# EAGLE board ETHERUNO (EAGLE 9.6.2)
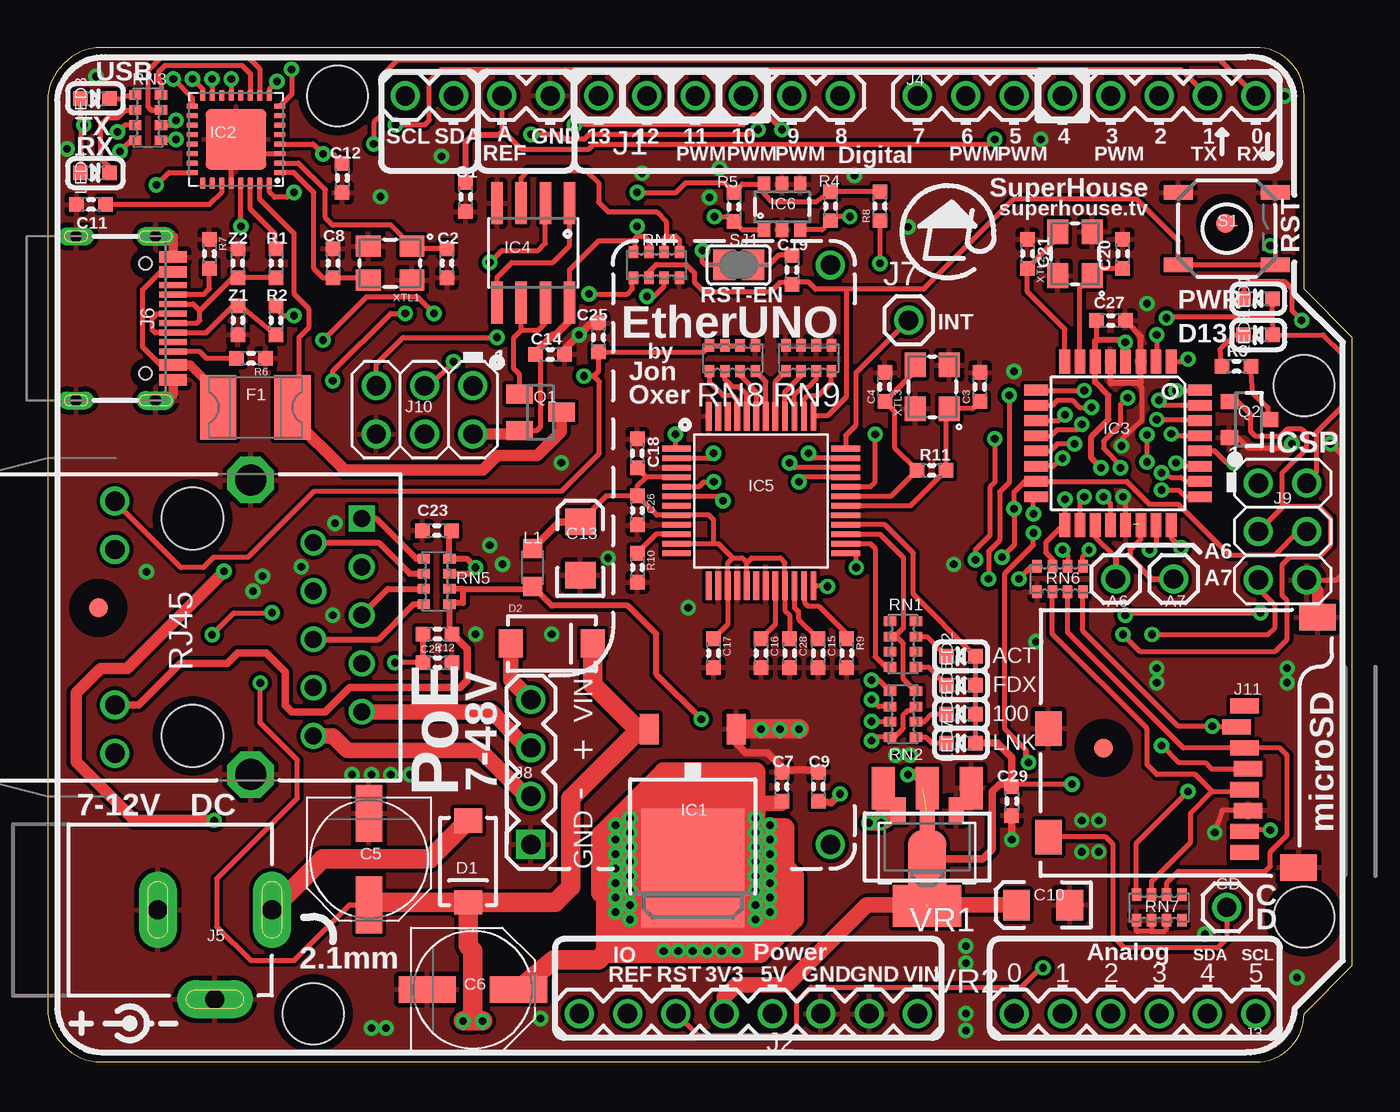
[diagram p4: board, top side]
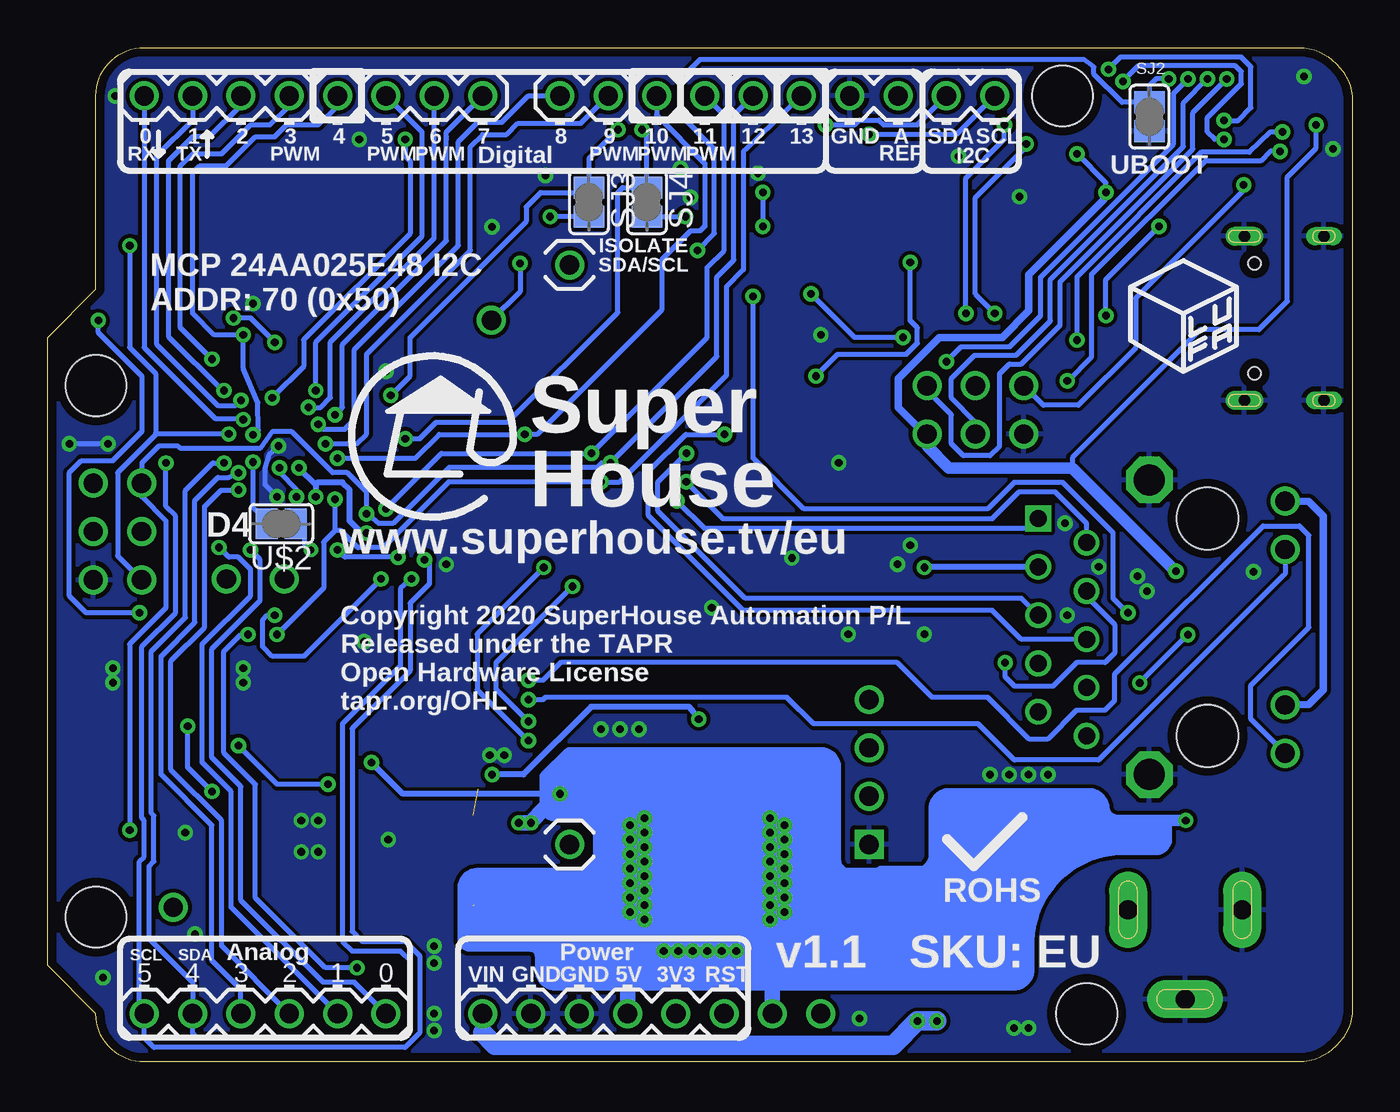
[diagram p5: board, bottom side, seen from below]

Size 68.58 x 53.34 mm. Coordinates in mm from the lower left corner, seen from the top.
Outline: 0,2.54 arc74 2.54,0 63.5,0 arc90 66.04,2.54 68.58,5.08 68.58,38.1 66.04,40.64 66.04,50.8 arc90 63.5,53.34 2.54,53.34 arc74 0,50.8 0,2.54
Copper layers (1*16): Top 0.035mm / dielectric 1.5mm / Bottom 0.035mm
Design rules "SuperHouse-Design-Rules": minimum track width 10mil, minimum drill 24mil, track to track 8mil, track to pad 8mil, pad to pad 8mil, via to via 8mil, smd to smd 6mil, copper to edge 18mil, drill to drill 8mil, minimum pad ring 7mil, minimum via ring 8mil, stop-mask expansion 4mil, vias tented up to drill 0.5mm, thermal gap 10mil
Holes 3.2 mm at 66.04,35.56 66.04,7.62 13.97,2.54 15.24,50.8
tRestrict: area 60.9,43.1 to 62.9,45.1; area 54.5,15.5 to 56.5,17.5; area 1.7,22.9 to 3.7,24.9

## Footprints (pad centres in the part's own frame; a part is rotated, then mirrored left to right if it is on the bottom)
1X01 = drill 1.016: 1 0,0
C0603 = smd 0.762 x 0.762: 1 -0.762,0; 2 0.762,0
PANASONIC_D = smd 3 x 1.4: + 2.4,0; - -2.4,0
EIA3216 = smd 1.4 x 1.6: A 1.4,0; C -1.4,0
SMA-DIODE = smd 1.27 x 1.47: A -2.15,0; C 2.15,0
1812 = smd 1.9 x 3.4: 1 -1.95,0; 2 1.95,0
FIDUCIAL-1X2.5 = smd 1 x 1: 1 0,0
DPACK = smd 1 x 1.6: 1 -2.28,-4.8; 3 2.28,-4.8 | smd 5.4 x 6.2: 2 0,2.5
ATMEL_QFN32 = smd 0.6 x 0.3: 1 -2.3,1.75; 2 -2.3,1.25; 3 -2.3,0.75; 4 -2.3,0.25; 5 -2.3,-0.25; 6 -2.3,-0.75; 7 -2.3,-1.25; 8 -2.3,-1.75; 17 2.3,-1.75; 18 2.3,-1.25; 19 2.3,-0.75; 20 2.3,-0.25; 21 2.3,0.25; 22 2.3,0.75; 23 2.3,1.25; 24 2.3,1.75 | smd 0.3 x 0.6: 9 -1.75,-2.3; 10 -1.25,-2.3; 11 -0.75,-2.3; 12 -0.25,-2.3; 13 0.25,-2.3; 14 0.75,-2.3; 15 1.25,-2.3; 16 1.75,-2.3; 25 1.75,2.3; 26 1.25,2.3; 27 0.75,2.3; 28 0.25,2.3; 29 -0.25,2.3; 30 -0.75,2.3; 31 -1.25,2.3; 32 -1.75,2.3 | smd 3.2 x 3.2: EXP 0,0
TQFP32-08 = smd 1.27 x 0.559: 1 -4.293,2.8; 2 -4.293,2; 3 -4.293,1.2; 4 -4.293,0.4; 5 -4.293,-0.4; 6 -4.293,-1.2; 7 -4.293,-2; 8 -4.293,-2.8; 17 4.293,-2.8; 18 4.293,-2; 19 4.293,-1.2; 20 4.293,-0.4; 21 4.293,0.4; 22 4.293,1.2; 23 4.293,2; 24 4.293,2.8 | smd 0.559 x 1.27: 9 -2.8,-4.293; 10 -2,-4.293; 11 -1.2,-4.293; 12 -0.4,-4.293; 13 0.4,-4.293; 14 1.2,-4.293; 15 2,-4.293; 16 2.8,-4.293; 25 2.8,4.293; 26 2,4.293; 27 1.2,4.293; 28 0.4,4.293; 29 -0.4,4.293; 30 -1.2,4.293; 31 -2,4.293; 32 -2.8,4.293
SO08 = smd 0.61 x 2.21: 1 -1.905,-2.616; 2 -0.635,-2.616; 3 0.635,-2.616; 4 1.905,-2.616; 5 1.905,2.616; 6 0.635,2.616; 7 -0.635,2.616; 8 -1.905,2.616
LQFP48 = smd 1.5 x 0.3: 1 -4.45,2.75; 2 -4.45,2.25; 3 -4.45,1.75; 4 -4.45,1.25; 5 -4.45,0.75; 6 -4.45,0.25; 7 -4.45,-0.25; 8 -4.45,-0.75; 9 -4.45,-1.25; 10 -4.45,-1.75; 11 -4.45,-2.25; 12 -4.45,-2.75; 25 4.45,-2.75; 26 4.45,-2.25; 27 4.45,-1.75; 28 4.45,-1.25; 29 4.45,-0.75; 30 4.45,-0.25; 31 4.45,0.25; 32 4.45,0.75; 33 4.45,1.25; 34 4.45,1.75; 35 4.45,2.25; 36 4.45,2.75 | smd 0.3 x 1.5: 13 -2.75,-4.45; 14 -2.25,-4.45; 15 -1.75,-4.45; 16 -1.25,-4.45; 17 -0.75,-4.45; 18 -0.25,-4.45; 19 0.25,-4.45; 20 0.75,-4.45; 21 1.25,-4.45; 22 1.75,-4.45; 23 2.25,-4.45; 24 2.75,-4.45; 37 2.75,4.45; 38 2.25,4.45; 39 1.75,4.45; 40 1.25,4.45; 41 0.75,4.45; 42 0.25,4.45; 43 -0.25,4.45; 44 -0.75,4.45; 45 -1.25,4.45; 46 -1.75,4.45; 47 -2.25,4.45; 48 -2.75,4.45
SOT23-6 = smd 0.65 x 0.8: 1 -0.95,-1.2; 2 0,-1.2; 3 0.95,-1.2; 4 0.95,1.2; 5 0,1.2; 6 -0.95,1.2
1X10-S = drill 1.016: 1 -11.43,0; 2 -8.89,0; 3 -6.35,0; 4 -3.81,0; 5 -1.27,0; 6 1.27,0; 7 3.81,0; 8 6.35,0; 9 8.89,0; 10 11.43,0
1X08-S = drill 1.016: 1 -8.89,0; 2 -6.35,0; 3 -3.81,0; 4 -1.27,0; 5 1.27,0; 6 3.81,0; 7 6.35,0; 8 8.89,0
1X06-S = drill 1.016: 1 -6.35,0; 2 -3.81,0; 3 -1.27,0; 4 1.27,0; 5 3.81,0; 6 6.35,0
POWER_JACK_SLOTS = drill 1 pad 2 long: GND 0,7.7; GNDBREAK 4.7,10.7; PWR 0,13.7
USB-C-16P = smd 0.6 x 1.45: A1B12 -3.225,5.095; A4B9 -2.45,5.095; A9B4 2.45,5.095; A12B1 3.225,5.095 | smd 0.3 x 1.45: A5 -1.25,5.095; A6 -0.25,5.095; A7 0.25,5.095; A8 1.25,5.095; B5 1.75,5.095; B6 0.75,5.095; B7 -0.75,5.095; B8 -1.75,5.095 | drill 0.6 pad 0.8 long: FIX1 -4.32,0; FIX4 4.32,0 | drill 0.6 pad 1 long: FIX2 -4.32,4.18; FIX3 4.32,4.18 | hole 0.65: 2.89,3.65; -2.89,3.65
FT-POE-MODULE-NOLABEL = drill 1.016 square: 1 0,0 | drill 1.016: 2 2.54,0; 3 5.08,0; 4 7.62,0; MNT1 0,-15.748; MNT2 30.48,-15.748
2X03-ICSP = drill 1.016: 1 -2.54,-1.27; 2 -2.54,1.27; 3 0,-1.27; 4 0,1.27; 5 2.54,-1.27; 6 2.54,1.27
MICRO-SD-SOCKET-PP = smd 0.8 x 1.5: 1 -8.94,10.7; 2 -7.84,10.3; 3 -6.74,10.7; 4 -5.64,10.9; 5 -4.54,10.7; 6 -3.44,10.9; 7 -2.34,10.7; 8 -1.24,10.7 | smd 1.8 x 1.4: CD1 -2.05,0.4; CD2 -7.75,0.4 | smd 1.4 x 1.9: GND1 -0.45,13.55; GND2 -13.6,14.55
L2012C = smd 1 x 1: 1 -1,0; 2 1,0
LED-0603 = smd 0.762 x 0.762: A -0.762,0; C 0.762,0
SOT23 = smd 1 x 1.4: 1 -0.95,-1.1; 2 0.95,-1.1; 3 0,1.1
SOT23-3 = smd 0.8 x 0.9: 1 -0.95,-1; 2 0.95,-1; 3 0,1.1
R0603 = smd 0.762 x 0.762: 1 -0.762,0; 2 0.762,0
CAY16 = smd 0.5 x 0.65: 1 -1.2,-0.675; 2 -0.4,-0.675; 3 0.4,-0.675; 4 1.2,-0.675; 5 1.2,0.675; 6 0.4,0.675; 7 -0.4,0.675; 8 -1.2,0.675
TACTILE_SMT-6MM = smd 1.524 x 0.762: 1 -2.54,1.905; 2 2.54,1.905; 3 -2.54,-1.905; 4 2.54,-1.905
SJC = smd 1.168 x 1.6: 1 -0.762,0; 2 0.762,0
SJ = smd 1.168 x 1.6: 1 -0.762,0; 2 0.762,0
HY931147C = drill 1.63 octagon: GND1 3.05,7.745; GND2 3.05,-7.745 | drill 0.9 square: P$1 8.89,5.715 | drill 0.9: P$2 6.35,4.445; P$3 8.89,3.175; P$4 6.35,1.905; P$5 8.89,0.635; P$6 6.35,-0.635; P$7 8.89,-1.905; P$8 6.35,-3.175; P$9 8.89,-4.445; P$10 6.35,-5.715 | drill 1.016: P$11 -4.08,6.625; P$12 -4.08,4.085; P$13 -4.08,-4.085; P$14 -4.08,-6.625 | hole 3.25: 0,5.715; 0,-5.715
SOT89 = smd 0.8 x 1.4: 1 -1.524,-1.905; 3 1.524,-1.905 | smd 0.8 x 1.9: 2 0,-1.651 | smd 2.032 x 3.65: 4 0,0.94
SOT-223 = smd 1.219 x 2.235: 1 -2.311,-3.099; 2 0,-3.099; 3 2.311,-3.099 | smd 3.6 x 2.2: 4 0,3.099
CRYSTAL-SMD-3X2 = smd 1.3 x 1.1: 1 -1.15,-0.9; 2 1.15,-0.9; 3 1.15,0.9; 4 -1.15,0.9
TVS0603 = smd 0.762 x 0.762: 1 -0.762,0; 2 0.762,0

## Placement (x,y rotation side)
A6  A6  [1X01]  56.13,25.4 0 top
A7  A7  [1X01]  59.18,25.4 0 top
C1  100nF 0603  [C0603]  21.97,45.48 270 top
C2  22pF 0603  [C0603]  21,42 90 top
C3  18pF  [C0603]  49,35.5 90 top
C4  18pF  [C0603]  44,35.5 90 top
C5  47uF 25V  [PANASONIC_D]  16.89,10.67 270 top
C6  47uF 25V  [PANASONIC_D]  22.35,3.81 0 top
C7  100nF 0603  [C0603]  38.61,14.48 90 top
C8  22pF 0603  [C0603]  15,42 270 top
C9  1uF 0603  [C0603]  40.51,14.48 90 top
C10  10uF 6.3V A TANT  [EIA3216]  52.32,8.26 180 top
C11  1uF 0603  [C0603]  2.29,45.09 180 top
C12  100nF 0603  [C0603]  15.49,46.48 270 top
C13  10uF 6.3V A TANT  [EIA3216]  28,27 90 top
C14  100nF  [C0603]  26.42,37.21 0 top
C15  10nF  [C0603]  40.5,21.5 270 top
C16  4.7uF  [C0603]  37.5,21.5 270 top
C17  100nF  [C0603]  35,21.5 270 top
C18  10nF  [C0603]  31,32 90 top
C19  100nF 0603  [C0603]  39.12,41.66 270 top
C20  15pF  [C0603]  56.5,42.5 270 top
C21  15pF  [C0603]  51.5,42.5 270 top
C23  10nF  [C0603]  20.45,27.94 180 top
C24  22nF  [C0603]  20.5,21 0 top
C25  100nF  [C0603]  28.96,38.1 90 top
C26  100nF  [C0603]  31,29 270 top
C27  100nF 0603  [C0603]  55.88,38.99 0 top
C28  100nF  [C0603]  39,21.5 270 top
C29  100nF  [C0603]  50.67,13.72 270 top
CD  M01-PLAIN  [1X01]  61.98,8.13 0 top
D1  1N4004  [SMA-DIODE]  22.1,10.54 270 top
D2  1N4004  [SMA-DIODE]  26.5,22 0 top
F1  500mA PTC 1812  [1812]  10.92,34.42 0 top
FID1  FIDUCIAL1X2.5  [FIDUCIAL-1X2.5]  61.9,44.1 0 top
FID2  FIDUCIAL1X2.5  [FIDUCIAL-1X2.5]  55.5,16.51 0 top
FID3  FIDUCIAL1X2.5  [FIDUCIAL-1X2.5]  2.67,23.88 0 top
IC1  MC33269DT-5.0  [DPACK]  33.91,12.7 180 top
IC2  ATMEGA16U2-MU  [ATMEL_QFN32]  9.91,48.51 180 top
IC3  ATMEGA328P TQFP32  [TQFP32-08]  56.26,32.53 270 top
IC4  LM358D  [SO08]  25.53,42.55 180 top
IC5  W5500-LQFP  [LQFP48]  37.5,29.5 0 top
IC6  MCP24AA025E48  [SOT23-6]  38.61,44.96 0 top
J1  Digital_8_13  [1X10-S]  30.23,50.8 180 top
J2  Power  [1X08-S]  36.83,2.54 0 top
J3  Analog  [1X06-S]  57.15,2.54 0 top
J4  Digital_0_7  [1X08-S]  54.61,50.8 180 top
J5  DC_2_1MM  [POWER_JACK_SLOTS]  -1.91,8 270 top
J6  USB-C-16P-16P  [USB-C-16P]  1.5,39.1 270 top
J7  INT  [1X01]  45.25,39 0 top
J8  FT-POE-MODULE3  [FT-POE-MODULE-NOLABEL]  25.4,11.43 90 top
J9  ICSP:MAIN  [2X03-ICSP]  64.91,27.89 270 top
J10  ICSP:USB  [2X03-ICSP]  19.81,34.29 180 top
J11  microSD  [MICRO-SD-SOCKET-PP]  52.2,9.78 270 top
L1  1uH 250mA 0805  [L2012C]  25.5,26 90 top
LED1  PWR/BLUE  [LED-0603]  63.63,40.13 180 top
LED2  YELLOW  [LED-0603]  48.01,21.34 180 top
LED3  TX/YEL  [LED-0603]  2.5,50.65 0 top
LED4  RX/GRN  [LED-0603]  2.5,46.76 0 top
LED5  GREEN  [LED-0603]  48.01,19.81 180 top
LED6  GREEN  [LED-0603]  48.01,18.29 180 top
LED7  YELLOW  [LED-0603]  48.01,16.76 180 top
LED8  D13/RED  [LED-0603]  63.63,38.23 180 top
Q1  FDN340P  [SOT23]  25.91,34.16 270 top
Q2  2N7002  [SOT23-3]  63.12,33.78 270 top
R1  22R  [R0603]  12,42 270 top
R2  22R  [R0603]  12,39 270 top
R3  1K  [R0603]  62.48,36.58 180 top
R4  4K7  [R0603]  41.15,45 270 top
R5  4K7  [R0603]  36.07,44.96 270 top
R6  5K1  [R0603]  10.7,37 180 top
R7  5K1  [R0603]  8.5,42.5 270 top
R8  10K  [R0603]  43.75,45 90 top
R9  10K  [R0603]  42,21.5 270 top
R10  12.4K 1%  [R0603]  31,26 270 top
R11  1M  [R0603]  46.47,31.11 0 top
R12  10R  [R0603]  20.5,22.5 180 top
RN1  1K  [CAY16]  44.96,21.97 270 top
RN2  1K  [CAY16]  44.96,18.29 270 top
RN3  1K  [CAY16]  5.28,49.66 270 top
RN4  10K  [CAY16]  32,41.91 0 top
RN5  49R9 1%  [CAY16]  20.45,25.27 270 top
RN6  1K  [CAY16]  53.21,25.4 0 top
RN7  2K2  [CAY16]  58.42,8.13 0 top
RN8  10K  [CAY16]  36,37 0 top
RN9  10K  [CAY16]  40,37 0 top
S1  RESET  [TACTILE_SMT-6MM]  61.98,43.81 0 top
SJ1  RESET-EN  [SJC]  36.32,41.91 0 top
SJ2  UBOOT  [SJ]  10.67,49.7 90 bottom
SJ3  SJC-NORMAL  [SJC]  40.13,45.21 270 bottom
SJ4  SJC-NORMAL  [SJC]  37.08,45.21 270 bottom
U1  HY931147C-RJ45  [HY931147C]  7.62,22.86 0 top
U$2  SJC-NORMAL  [SJC]  56.3,28.3 180 bottom
VR1  LD1117-SOT89  [SOT89]  46.23,11.3 180 top
VR2  LD1117-SOT223  [SOT-223]  46.23,11.3 180 top
XTL1  16MHz  [CRYSTAL-SMD-3X2]  18,42 180 top
XTL2  16MHz  [CRYSTAL-SMD-3X2]  54,42.5 90 top
XTL3  25MHz  [CRYSTAL-SMD-3X2]  46.5,35.5 90 top
Z1  PGB1010603  [TVS0603]  10,39 270 top
Z2  PGB1010603  [TVS0603]  10,42 90 top

## Tracks (layer width: path | path; a pad name or v marks a point on that pad's centre or on a via)
1V2O
  Top 0.254: C15.1 39.46,23.3 39.46,23.69 39.25,23.9 IC5.22
3.3V  (via drill 0.4)  (2 unrouted)
  Top 0.254: J11.4 61.16,15.42 60.83,15.75 59.44,15.75 v58.55,16.64 | IC4.2 26.16,43.05 25.78,42.67 23.88,42.67 v23.24,42.04 | 28.7,36.07 v28.19,36.07 | 28.7,36.07 28.96,36.32 C25.1 34.46,37.34 RN8.8 RN8.7 RN8.6 | v53.85,14.61 50.8,14.61 C29.1 | LED7.A LED6.A LED5.A LED2.A 45.5,24.6 45.5,26.75 44,28.25 IC5.28 | 46.23,12.75 46.23,10.75 VR2.4 | VR2.4 | U1.P$11 3.54,29.46 7,26 8.17,26 8.7,26.53 10.53,26.53 14,30 27,30 29,32 29,35.77 28.7,36.07
  Top 0.305: 21.84,24.87 RN5.6 | 21.84,24.87 21.84,24.13 21.12,24.13 RN5.5 21.12,22.64 R12.1 | 21.84,24.87 25.37,24.87 L1.1 26.5,24 30.5,24 32,22.5 32,20.39 v34.35,18.03
  Top 0.406: U1.P$13 4.8,18.77 6.98,20.95 9.46,20.95 10,21.5 11.5,21.5 12.5,20.5 12.5,18.74 12.83,18.41 14.61,18.41 15.88,19.68 21.68,19.68 22.05,20.05 22.05,21.71 R12.1 | LED7.A 49.91,16.76 50.67,16 C29.1 50.63,14.61 50.04,14.61 49.66,14.22 49.66,11.18 49.15,10.67 46.31,10.67 46.23,10.75 | 45.97,14.35 46.02,14.4 | VR2.4 46.23,12.75 46.23,14 VR2.2 | VR1.4 VR2.4 | VR2.4 | VR2.4 46.23,8.25
  Top 0.61: 46.02,14.4 VR2.2 46.31,14.32 46.31,10.67 | v45.21,15.11 45.89,15.11 46.23,14.77 46.23,14
  Top 0.813: 46.18,8.26 C10.A | 46.23,8.25 43.05,8.25 41.27,6.48 38.86,4.06 36.2,4.06 35.56,3.43 J2.4
  Bottom 0.254: v58.55,16.64 56.52,14.61 v53.85,14.61 | v23.24,42.04 23.24,38.99 22.86,38.61 22.86,37.8 23.44,37.21 27.05,37.21 v28.19,36.07
  Bottom 0.305: v34.35,18.03 34.86,18.67 40.01,18.67 43.57,15.11 v45.21,15.11
  Bottom 0.406: U1.P$13 2.29,18.8 1.52,19.56 1.52,28.7 2.29,29.46 U1.P$11
3V3A
  Top 0.254: IC5.17 36.75,26.25 | 36.75,26.25 36.5,26.5 36,26.5 | 36,26.5 35.75,26.25 IC5.15 35.75,23.01 C17.1 | C28.1 39,23.5 38.75,23.75 IC5.21 38.75,26.25 38.5,26.5 37,26.5 36.75,26.25 | IC5.11 35,27.25 | 35,27.25 35.25,27.25 36,26.5 | 35,27.25 35,28.5 34.75,28.75 IC5.8 32.01,28.75 C26.1 | IC5.4 33.03,30.77 31.47,30.77 | 31.47,30.77 C18.1 | C26.1 31,30.3 31.47,30.77 | 27.91,28.41 C13.A 29.36,29.76 C26.1
  Top 0.406: 27.27,28.4 C13.A 26.9,28.4 L1.2
5V  (via drill 0.4)
  Top 0.254: 1.75,49.28 LED3.A | IC2.32 11.66,45.75 11.94,45.47 12.57,45.47 v12.95,45.72 | 1.75,49.28 LED4.A | v1.91,49.28 1.75,49.28 | 64.38,39.19 LED8.A 67.06,38.23 68.07,37.21 68.07,34.48 66.67,33.08 66.67,30.99 66.18,30.49 J9.2 | 64.38,39.19 LED1.A | IC3.18 54.26,29.5 v54.48,29.72 | RN4.7 31.6,43.2 31.37,43.43 30.99,43.43 | 30.99,43.43 30.86,43.31 30.86,43.18 | 30.86,43.18 30.86,42.64 RN4.8 | IC4.8 27.43,41.66 28.96,43.18 30.86,43.18 | C14.1 25.91,36.87 25.91,33.4 25.72,33.21 Q1.2 | 64.38,39.19 58.85,39.19 v58.8,39.12 | v56.64,37.85 56.64,37.83 56.53,37.72 | IC1.2 34.04,10.2 34.04,10.16 | 37.21,13.59 37.08,13.59 v37.21,12.83 | 29.84,10.41 v29.84,10.16 | 29.72,9.78 29.84,9.65 v29.84,9.4 | v29.84,7.87 v29.84,8.64 30.23,8.64 | 36.45,6.48 36.7,6.48 36.83,6.35 36.45,6.35 | v51.82,27.81 51.82,27.18 50.29,25.65 50.29,17.53 51.44,16.38 51.44,16.26 | 37.85,12.45 v37.97,12.45 37.97,12.32 | v30.99,43.94 30.99,43.43 | v30.99,45.72 33.02,45.72 33.53,46.23 35.56,46.23 R5.1 36.51,46.16 IC6.6 37.66,45.65 38.1,45.21 40.39,45.21 R4.1 R8.2 | C27.1 55.12,37.97 | IC2.4 13.95,48.26 v14.47,47.75 14.98,47.75 C12.1
  Top 0.305: IC3.4 56.66,37.59 56.53,37.72 56.26,37.97 55.12,37.97 55.06,37.92 IC3.6 55.06,35.74 55.75,35.05 55.75,33.78 54.86,32.89 54.86,31.75 v55.37,31.24 | 51.44,16.26 51.44,15.88 v51.56,15.75
  Top 0.406: 38.57,13.59 C7.1 | C9.1 41.19,13.63 v41.66,14.1 | IC4.8 27.43,38.99 26.67,38.23 26.54,38.23 25.57,37.25 C14.1 | VR2.3 43.92,14.88
  Top 0.61: Q1.2 24.61,33.02 J10.2 | v9.28,25.8 4.18,20.7 2.79,20.7 1.5,19.41 1.5,15.77 4.57,12.7 v8.76,12.7 | v36.2,5.84 v35.43,5.84 v34.67,5.84 v33.91,5.84 v33.15,5.84 v32.38,5.84 | v36.2,5.84 36.2,6.1 36.45,6.1 | 36.45,6.48 36.45,6.35 36.45,5.84 v36.2,5.84 | 30.23,10.67 30.23,10.54 v30.61,10.54 | VR1.3 44.07,12.57 v43.81,12.57
  Top 0.813: 37.21,13.59 38.57,13.59 | v30.61,7.49 v30.61,10.54 v30.61,12.83 30.86,12.83 | v37.21,7.49 v37.21,8.26 v37.21,9.02 37.21,12.32 v37.21,12.83 | v43.18,12.57 v43.81,12.57 43.92,12.68 VR2.3
  Top 1.016: C6.+ 26.6,5.37 28.96,5.37 30.23,6.86 | IC1.2 30.23,6.86 | 34.04,15.24 34.04,10.16 | 34.04,15.24 32.38,15.24 29.08,11.94 29.08,8.89 29.34,9.78 | 29.34,9.78 29.34,5.71 37.21,5.71 | 37.21,5.71 37.21,12.32 | 37.21,12.32 37.21,13.59 37.21,15.24 34.04,15.24 | 29.34,9.78 29.72,9.78 30.86,10.92 30.86,12.83 32.64,14.61 36.45,14.61 36.45,6.48 30.23,6.48 30.23,6.86 | 30.23,6.86 30.23,8.64 30.99,9.4 30.99,6.99 35.94,6.99 35.94,13.84 32.26,13.84 32,13.59 36.07,13.59 | 29.84,10.41 29.84,12.19 30.23,12.19 30.23,10.67 | 37.21,5.71 37.47,5.71 39.24,7.49 39.24,9.78 38.73,10.29 38.73,12.32 38.61,12.32 | 37.97,12.32 38.61,12.32 | 37.21,12.32 37.97,12.32 | 37.97,12.32 v37.97,11.68 v37.97,10.92 v37.97,10.16 v37.97,9.4 v37.97,8.64 v37.97,7.87 37.97,6.73 | 38.61,12.32 38.61,6.99 | 31.24,11.18 31.24,9.91 29.97,9.91 29.97,9.4 | 29.97,9.4 29.97,9.14 | v29.84,9.4 29.97,9.4
  Bottom 0.254: v1.91,49.28 1.91,48.05 3.42,46.54 3.42,40 4.92,38.5 8,38.5 14.72,31.78 14.72,31.24 | v41.66,14.1 41.7,14.1 42.16,13.63 42.16,13.84 42.29,13.97 42.29,14.35 | v58.8,39.12 57.91,39.12 v56.64,37.85 | 42.42,13.34 42.44,13.35 | 42.29,13.21 42.16,13.34 | 40.26,14.73 40.39,14.86 40.64,14.86 | J10.2 22.48,33.02 | 21.97,12.7 21.84,12.57 21.84,12.45 | 21.84,11.94 21.97,11.81 21.97,11.56 21.84,11.56 | 21.97,11.18 21.84,11.18 | 21.97,10.92 21.84,10.79 21.84,10.41 | 15.11,10.41 17.02,10.29 15.62,10.03 15.88,9.78 15.88,9.65 16.26,9.27 16.51,9.02 16.51,8.89 | 17.27,8.13 17.27,7.87 | 21.21,14.1 21.21,13.84 | v29.84,11.68 v29.84,12.45 | v29.84,10.92 30.23,10.54 v30.61,10.54 | 36.83,6.35 35.69,6.35 35.56,6.48 | v12.95,45.72 12.95,46.23 v14.47,47.75 | v30.99,45.72 v30.99,43.94
  Bottom 0.305: 54.48,30.35 v55.37,31.24 | 54.48,30.35 v54.48,29.72 | 54.48,30.35 54.36,30.48 53.09,30.48 52.7,30.1 52.7,28.45 52.07,27.81 v51.82,27.81 | v51.56,15.75 49.91,14.1 v41.66,14.1
  Bottom 0.406: 22.48,33.02 23.88,34.42 23.88,35.94 21.72,38.1 18.41,38.1 17.02,39.5 17.02,41.4 13.08,45.34 v12.95,45.72
  Bottom 0.61: J10.2 22.35,32.38 21.21,31.24 14.72,31.24 v9.28,25.8 | 9.78,12.7 9.78,11.81 arc90 10.29,11.18 11.81,11.18 arc-90 17.02,6.35 | 17.02,6.35 17.45,9.86 | 17.45,9.86 19.81,7.49 v30.61,7.49 | 41.17,16.26 41.1,16.08 | 42.42,13.46 42.42,13.34 42.29,13.21 42.16,13.08 39.5,13.08 | 42.29,14.35 42.16,14.48 | 42.16,14.48 40.77,15.88 | 42.16,13.84 40.64,15.37 | 42.16,13.34 40.64,14.86 | 40.26,14.73 41.78,13.21 | 17.45,9.86 26.37,9.86 arc90 27.18,10.67 27.18,15.49 arc-90 27.94,16.26 41.17,16.26 | 41.17,16.26 42.42,15.01 42.42,13.46 | 42.42,13.46 arc-90 41.91,12.95 40.64,12.95 arc90 39.62,11.94 39.62,11.68 | 39.62,11.18 39.62,10.92 arc90 40.64,9.91 45.97,9.91 arc-90 46.74,9.14 | 42.67,5.59 42.67,4.83 arc-90 41.91,4.06 17.78,4.06 arc-90 17.02,4.83 17.02,5.08 | 46.74,6.48 arc-90 46.35,6.1 43.18,6.1 | 46.74,6.99 46.74,7.49 | 46.74,8.13 46.74,8.64 | 17.02,6.1 17.02,5.59 | 17.02,6.6 17.02,7.11 | 17.02,7.62 17.02,9.14 | 17.02,9.14 arc-90 17.78,9.91 27.18,9.91 | 27.18,9.91 27.94,9.91 | 27.94,9.91 27.94,7.48 | 17.02,9.14 46.74,9.14 | 46.74,9.14 46.74,8.64 | 46.74,8.64 17.27,8.64 17.27,8.13 46,8.13 46.74,8.13 | 46.74,7.49 46.74,8.13 | 17.02,7.62 46.74,7.49 | 17.02,7.11 17.02,7.62 | 17.02,7.11 46.74,6.99 | 46.74,6.48 46.74,6.99 | 17.02,6.6 46.74,6.48 | 17.02,6.35 17.02,6.6 | 17.02,6.35 17.02,6.1 | 17.02,6.1 43.18,6.1 | 43.18,6.1 arc90 42.67,5.59 | 17.02,5.59 42.67,5.59 | 17.02,5.59 17.02,5.08 | 17.02,5.08 30.5,5.08 42.42,5.08 42.42,4.57 17.53,4.57 17.27,7.87 | 17.27,7.87 17.14,9.53 | 17.14,9.53 42.16,9.4 42.16,9.65 39.62,9.65 39.62,9.91 27.94,9.91 | 27.18,9.91 27.18,10.16 39.62,10.16 39.62,10.67 27.43,10.67 27.43,11.18 39.62,11.18
  Bottom 0.61: 39.62,11.18 39.62,11.68 | 39.62,11.68 v29.84,11.68 27.43,11.68 27.43,12.19 39.37,12.19 39.37,12.45 | 39.37,12.45 39.62,12.45 | 39.37,12.45 v29.84,12.45 27.43,12.45 27.43,12.95 39.62,12.95 39.62,13.46 27.43,13.46 27.43,13.97 42.16,13.97 42.16,14.48 | 42.16,14.48 27.43,14.48 27.43,14.99 41.91,14.99 41.91,15.24 41.15,15.24 | 41.15,15.24 27.43,15.24 27.43,15.75 41.15,15.75 41.15,15.24 | 22.99,9.91 arc-90 21.97,10.92 21.97,11.18 21.97,11.56 21.97,12.7 | 21.97,13.34 21.97,12.95 | 21.97,12.95 21.97,12.7 | 21.97,13.34 arc90 21.21,14.1 13.84,14.1 arc90 13.08,13.34 13.08,13.46 arc-90 12.32,12.7 9.78,12.7 | v8.76,12.7 9.78,12.7 | 13.46,13.84 21.21,13.84 21.46,13.84 | 21.97,13.34 13.34,13.34 | 21.97,12.95 12.95,12.95 | 21.97,12.7 12.57,12.7 | 21.84,12.45 10.03,12.45 | 21.84,11.94 10.03,11.94 | 21.84,11.56 10.16,11.56 | 21.84,11.18 13.59,11.18 | 21.84,10.79 14.48,10.79 | 15.11,10.41 21.84,10.41 21.97,10.41 | 15.62,10.03 24.77,10.03 | 17.14,9.53 46.48,9.53 | 17.27,7.87 46.61,7.87 | 15.88,9.65 23.62,9.65 | 16.26,9.27 24,9.27 | 16.51,8.89 24.26,8.89
  Bottom 0.813: 38.1,6.6 37.97,6.6 v37.21,7.49 v37.21,8.26 v37.21,9.02 | v30.61,7.49 v30.61,8.26 v30.61,9.02 v30.61,9.78 v30.61,10.54 v30.61,11.3 | v30.61,12.06 v30.61,12.83 30.73,11.68 30.86,11.56 30.86,11.3 | v37.21,12.83 v37.21,12.06 v37.21,11.3 v37.21,10.54 v37.21,9.78 | v37.21,12.83 37.08,13.59 37.21,13.72 v37.21,12.83 | 43.22,12.57 v43.81,12.57 | 43.22,12.57 v43.18,12.57 | 43.22,12.57 42.44,13.35 42.16,13.63 37.88,13.63 v37.21,12.83 | J2.5 38.1,6.35 36.83,6.35 36.45,6.35 | J2.2 30.48,5.06 30.5,5.08
  Bottom 1.016: 36.83,6.35 36.7,6.35 v36.2,5.84
A0  (via drill 0.4)
  Top 0.254: v57.91,26.92 58.29,27.3 58.29,28.2 IC3.23
  Bottom 0.254: J3.1 52.45,4.19 54.1,4.19 58.42,8.51 58.42,14.48 59.94,16 59.94,21.72 57.4,24.26 57.4,26.42 v57.91,26.92
A1  (via drill 0.4)
  Top 0.254: v59.56,27.05 59.06,27.55 IC3.24
  Bottom 0.254: J3.2 58.93,8.13 58.93,14.22 60.45,15.75 60.45,21.97 57.91,24.51 57.91,25.91 58.55,26.54 59.05,26.54 v59.56,27.05
A2  (via drill 0.4)
  Top 0.254: IC3.25 59.81,29.73 59.46,30.07 v58.55,30.07
  Bottom 0.254: J3.3 59.44,6.1 59.44,12.7 62.1,15.37 62.1,21.08 60.33,22.86 60.33,29.21 59.46,30.07 v58.55,30.07
A3  (via drill 0.4)
  Top 0.254: IC3.26 59.87,30.53 59.56,30.73 59.05,30.73 v58.55,30.99
  Bottom 0.254: J3.4 58.42,3.81 59.94,5.33 59.94,12.45 62.61,15.11 62.61,21.34 60.83,23.11 60.83,29.53 59.63,30.73 59.05,30.73 v58.55,30.99
A4_SDA  (via drill 0.4)
  Top 0.254: IC3.27 59.48,31.33 v59.31,31.5 | v50.55,35.05 50.55,30.48 50.04,29.97 50.04,27.43 49.45,26.85 v49.45,25.4 | v38.61,49.02 37.85,49.78 37.08,49.78 36.58,49.28 v27.69,49.28
  Bottom 0.254: J1.9 22.86,49.28 24.64,49.28 24.89,49.53 25.91,49.53 26.16,49.28 v27.69,49.28 | v59.31,31.5 59.89,31.5 61.34,30.04 61.34,23.37 63.12,21.59 63.12,13.08 62.99,12.95 62.99,10.54 63.25,10.29 63.25,6.48 60.96,4.19 J3.5 60.96,1.52 60.71,1.27 50.04,1.27 49.53,1.78 49.53,5.33 50.04,5.84 52.58,5.84 53.09,6.35 53.09,17.78 50.04,20.83 50.04,24.89 v49.45,25.4 | v38.61,49.02 40.13,47.5 SJ3.1 40.39,45.72 42.67,45.72 43.43,44.96 43.43,44.2 49.53,38.1 49.53,36.07 v50.55,35.05
A5_SCL  (via drill 0.4)
  Top 0.254: IC3.28 61.34,32.13 61.98,31.5 v62.36,31.5 | v49.78,32.77 49.78,30.48 49.53,30.23 49.53,27.69 48.77,26.92 v48.77,26.42 | v37.34,49.02 37.08,49.02 36.83,48.77 28.45,48.77 28.19,48.51 27.18,48.51 26.92,48.77 v25.4,48.77
  Bottom 0.254: v62.36,31.5 62.36,29.21 61.85,28.7 61.85,23.62 63.63,21.84 63.63,12.83 63.5,12.7 63.5,10.79 63.75,10.54 63.75,2.79 J3.6 63.5,1.27 62.99,0.76 49.78,0.76 49.02,1.52 49.02,5.59 49.78,6.35 52.07,6.35 52.58,6.86 52.58,17.53 49.53,20.57 49.53,24.13 48.52,25.14 48.52,26.17 v48.77,26.42 | J1.10 20.83,48.77 25.15,48.77 | v49.78,32.77 49.03,32.77 48.16,33.64 44.39,33.64 38.61,39.41 38.61,45.72 38.35,45.97 SJ4.1 37.08,48.77 v37.34,49.02
  Bottom 0.305: 25.15,48.77 v25.4,48.77
ACTLED
  Top 0.254: RN2.8 44.98,20.14 44.98,22 44.61,22.37 RN1.2 44.52,22.37 44.98,22.82 44.98,26.52 43.75,27.75 IC5.27
AREF  (via drill 0.4)
  Top 0.254: IC3.20 55.86,29.36 v55.5,29.72 | v56.39,31.24 56.39,31.37 55.5,32.26 55.5,32.64 56.39,33.53 56.39,34.54 v56.77,34.92 | v49.78,48.51 49.53,48.26 28.7,48.26 28.45,48.01 24.89,48.01 23.88,49.02 | J1.8 23.88,49.02 | 23.88,49.02 23.88,48.9
  Top 0.305: C1.1 21.97,48.39 22.35,48.77 23.75,48.77 23.88,48.9
  Bottom 0.254: v55.5,29.72 55.5,30.1 56.39,30.99 v56.39,31.24 | v56.77,34.92 55.12,36.58 55.12,37.97 49.53,43.56 49.53,47.37 49.78,47.62 v49.78,48.51
CIPO2  (via drill 0.4)
  Top 0.254: IC2.17 7.61,50.69 v6.6,51.69
  Bottom 0.254: v6.6,51.69 8.38,49.91 8.38,48.01 15.37,41.02 15.37,38.73 17.4,36.7 18.03,36.7 18.54,36.2 18.54,32.38 19.05,31.88 20.45,31.88 21.08,32.51 21.08,34.04 22.35,35.31 J10.1
COPI2  (via drill 0.4)
  Top 0.254: IC2.16 8.16,51.15 v7.62,51.69
  Bottom 0.254: v7.62,51.69 8.89,50.42 8.89,48.13 15.88,41.15 15.88,38.96 17.68,37.16 19.86,37.16 21.08,35.94 21.08,34.92 19.81,33.66 J10.4
D0_RX  (via drill 0.4)
  Top 0.254: RN3.4 4.39,48.46 v3.81,47.88 | IC3.30 60.5,33.78 v58.29,33.78 | J4.1 61.59,52.7 18.41,52.7 17.53,51.82 17.53,49.78 17.14,49.4 v17.14,48.27 | v14.99,35.81 14.99,36.32 18.03,39.36 v18.8,39.36
  Bottom 0.254: v3.81,47.88 4.32,47.88 4.83,47.37 7.75,47.37 13.72,41.4 13.72,37.07 14.97,35.81 v14.99,35.81 | J4.1 63.5,37.56 59.77,33.84 58.35,33.84 v58.29,33.78 | v17.14,48.27 17.14,48.12 19.81,45.45 19.81,40.38 v18.8,39.36
D1_TX  (via drill 0.4)
  Top 0.254: RN3.3 4.04,49.26 v3.68,48.9 | IC3.31 60.54,34.54 58.67,34.54 v58.42,34.8 | J4.2 59.56,52.2 20.7,52.2 20.07,51.56 20.07,49.53 19.81,49.28 v18.29,49.28 | v20.31,39.36 19.45,40.22 16.74,40.22 v14.48,37.96
  Bottom 0.254: v3.68,48.9 4.32,48.9 5.41,47.83 7.95,47.83 14.48,41.27 v14.48,37.96 | J4.2 60.96,49.53 62.87,47.62 62.87,37.76 59.64,34.53 58.69,34.53 v58.42,34.8 | v20.31,39.36 v20.32,39.37 20.32,46.48 18.29,48.51 v18.29,49.28
D2  (via drill 0.4)
  Top 0.254: IC3.32 60.53,35.31 v59.31,35.31
  Bottom 0.254: J4.3 58.42,50.29 60.07,48.64 60.96,48.64 62.23,47.37 62.23,38.15 59.41,35.33 59.33,35.33 v59.31,35.31
D3  (via drill 0.4)
  Top 0.254: IC3.1 59.82,36.83 v59.94,36.96
  Bottom 0.254: v59.94,36.96 61.59,38.61 61.59,47.12 60.96,47.75 59.44,47.75 57.91,49.28 56.9,49.28 55.88,50.29 J4.4
D4  (via drill 0.4)  (1 unrouted)
  Top 0.254: v58.29,38.23 58.29,36.85 IC3.2 | v57.78,31.55 v57.78,32.97
  Bottom 0.254: J4.5 53.34,50.29 54.36,49.28 56.01,49.28 56.64,48.64 57.66,48.64 59.18,47.12 60.58,47.12 60.96,46.74 60.96,39.37 59.82,38.23 v58.29,38.23 58.29,36.45 57.53,34.67 57.51,33.22 v57.78,32.97 | 57.34,28.58 57.34,28.3 | v57.78,31.55 57.78,29.18 57.06,28.46 U$2.2
D5  (via drill 0.4)
  Top 0.254: IC3.9 51.99,35.31 v54.48,35.31
  Bottom 0.254: v54.48,35.31 54.48,37.85 48.9,43.43 48.9,48.5 48.9,48.64 48.9,48.9 J4.6
D6  (via drill 0.4)
  Top 0.254: IC3.10 51.98,34.54 52.83,34.54 53.09,34.8 53.85,34.8 54.23,34.42 v54.86,34.42
  Bottom 0.254: v54.86,34.42 54.23,34.42 53.72,34.92 53.72,37.85 48.26,43.31 J4.7
D7  (via drill 0.4)
  Top 0.254: IC3.11 53.16,33.73 v53.47,34.04
  Bottom 0.254: v53.47,34.04 53.09,34.42 53.09,37.72 47.62,43.18 47.62,48.5 47.62,48.64 47.62,48.9 J4.8
D8  (via drill 0.4)
  Top 0.254: IC3.12 52.7,32.89 53.06,33.25 54.12,33.26 v54.36,33.53
  Bottom 0.254: J1.1 43.31,50.8 44.7,49.4 45.97,49.4 46.99,48.39 46.99,42.93 52.45,37.47 52.45,33.78 52.96,33.27 54.1,33.27 v54.36,33.53
D9  (via drill 0.4)
  Top 0.254: IC3.13 52.7,32.13 53.09,32.51 v53.98,32.51
  Bottom 0.254: v53.98,32.51 52.32,32.51 51.82,33.02 51.82,37.21 46.35,42.67 46.35,48.13 45.72,48.77 44.45,48.77 43.86,49.36 40.56,49.36 J1.2
D10_CS  (via drill 0.4)
  Top 0.254: IC3.14 52.87,31.33 v53.34,31.75 | IC5.32 43.25,30.25 43.5,30.5 v43.5,33
  Bottom 0.254: J1.3 36.58,49.78 34.04,47.24 34.04,43.94 34.29,43.69 34.8,43.69 36.31,42.18 36.31,39.54 42.85,33 v43.5,33 48,33 49.25,31.75 v53.34,31.75
D11_COPI  (via drill 0.4)
  Top 0.254: J9.4 65.74,27.89 64.52,26.67 62.1,26.67 59.44,29.34 57.91,29.34 56.72,30.53 IC3.15 51.36,30.53 50.8,29.97 v50.8,29.08 50.8,27.18 v50.16,26.54 | RN6.6 53.61,26.65 v53.34,26.92 | IC5.35 40.25,31.75 v40,32
  Bottom 0.254: v53.34,26.92 52.96,26.54 v50.16,26.54 | J1.4 33.02,49.78 33.02,42.67 33.91,41.78 33.91,38.09 v40,32 47.88,32 v50.8,29.08
D12_CIPO  (via drill 0.4)
  Top 0.254: J11.7 62.9,12.16 62.87,12.19 v64.26,12.19 | IC5.34 39.25,31.25 v39,31.5 | v51.82,28.83 51.82,29.58 IC3.16
  Bottom 0.254: v64.26,12.19 64.26,21.97 62.36,23.88 62.36,28.45 63.64,29.73 J9.1 63.63,30.44 63.63,31.5 62.74,32.38 61.72,32.38 61.59,32.26 57.4,32.26 56.77,33.15 55.75,33.15 53.59,30.99 52.83,30.99 51.82,29.97 v51.82,28.83 51.18,28.32 50.42,28.32 47.47,31.27 39.7,31.27 39.46,31.5 v39,31.5 33.4,37.1 33.4,41.27 32.51,42.16 32.51,49.78 J1.5
D13_SCK  (via drill 0.4)
  Top 0.254: J9.3 64.9,29.15 64.9,29.21 | 64.9,29.21 64.9,30.99 66.17,32.26 66.17,33.02 65.91,33.27 65.15,33.27 64.77,32.89 63.5,32.89 63.25,33.15 63.25,34.04 62.55,34.73 Q2.1 | 53.46,28.32 52.45,27.3 52.45,26.8 52.83,26.42 52.83,26.09 RN6.7 | v53.47,29.59 v53.46,29.59 53.46,28.32 | 53.46,28.32 IC3.17 | 64.9,29.21 66.8,29.21 67.44,28.57 67.44,27.18 66.8,26.54 65.28,26.54 64.9,26.16 64.9,24.51 65.15,24.26 65.15,22.23 64.52,21.59 57.4,21.59 v56.52,22.48 | IC5.33 39.75,30.75 v39.5,30.5
  Bottom 0.254: 53.47,27.94 53.46,27.95 53.17,27.95 52.28,27.05 50.95,27.05 47.5,30.5 v39.5,30.5 38.5,30.5 32.89,36.11 32.89,40.77 32,41.66 32,47.88 31.88,48.01 J1.6 | 53.47,27.94 54.08,27.33 54.08,24.92 v56.52,22.48 | 53.47,27.94 v53.47,29.59
DTR  (via drill 0.4)
  Top 0.254: v9.65,51.69 v9.66,51.69 IC2.13 | SJ1.1 34.59,41.91 34.42,42.08 v34.42,42.67
  Bottom 0.254: v34.42,42.67 33.53,43.56 33.53,48.01 35.31,49.78 35.31,51.7 34.3,52.7 14.1,52.7 13.59,52.32 13.59,51.94 12.11,50.46 SJ2.2 10.67,51.33 10.31,51.69 v9.65,51.69
FDXLED
  Top 0.254: IC5.26 43.25,27.25 43.5,27 43.5,21.31 44.04,20.77 RN1.4
GND  (via drill 0.4)
  Top 0.254: IC2.3 10.66,47.76 IC2.EXP 9.66,48.26 IC2.28 | RN7.1 57.22,6.92 57.28,6.86 58.02,6.86 | RN7.3 58.8,7.43 58.8,6.99 58.67,6.86 58.02,6.86 | RN7.2 58.02,6.86 | J11.6 61.73,13.22 v61.34,12.06 | Q2.2 62.55,32.83 63.12,32.26 65.15,32.26 v65.41,32.51 | IC3.21 56.66,29.57 v56.52,29.72 | v56.44,32.38 56.44,32.72 57.53,33.78 57.53,35.43 57.28,35.69 | v67.44,32.51 68.07,31.88 68.07,25.65 67.77,25.35 J9.6
  Top 0.305: IC3.5 55.88,36.8 55.88,35.69 57.28,35.69 57.4,35.69 57.46,35.74 IC3.3 57.46,38.13 56.77,38.86 C27.2
  Top 0.406: v50.67,11.68 C29.2 | 38.61,15.37 38.61,15.49 37.85,16.26 36.7,16.26 36.2,16.76 IC1.1 | 38.61,15.37 C7.2 | 38.61,15.37 40.47,15.37 C9.2 | C14.2 27.27,37.55 28.57,38.86 C25.2
  Top 0.508: J6.A12B1 6.59,35.09 6.28,34.78 J6.FIX3 | J6.A1B12 6.59,43.41 6.5,43.5 5.76,43.5 J6.FIX2
  Top 0.61: 66.75,23.42 66.75,24.78 J9.6
  Top 1.016: v39.5,17.5 v38.5,17.5 v37.5,17.5 IC1.1
  Bottom 0.254: v56.52,29.72 57.15,30.35 57.15,31.24 56.9,32 v56.44,32.38 | v67.44,32.51 v65.41,32.51
  other vias: 65.66,4.45 48.26,2.54 57.78,39.88 58.29,20.7 58.29,19.94 27,31.5 20.7,47.62 2.54,51.82 44.58,16.13 45.34,16.13 27.94,38.23 35.31,46.99 42.42,46.61 1.02,48.01 51.94,22.1 65.15,20.7 65.15,19.94 47.62,26.16 50.8,36.32 65.02,50.8 52.2,48.51 5.21,25.78 48.26,1.65 25.91,2.29 48.26,5.21 48.26,6.1 29.46,26.5 23.91,26.18 55.24,11.05 55.24,12.7 23.24,27.18 15.11,28.32 13.34,26.04 14.99,23.5 11.3,25.54 10.8,24.76 33.67,23.88 26.5,22.5 22.5,22.5 19.05,15.11 18.03,15.11 17.02,15.11 16,15.11 54.36,11.05 54.36,12.7 60.83,6.73 17.02,1.78 17.78,1.78 31.24,46.74 45.22,43.91 34.8,45.47 17.5,45.5
  pour Bottom: 0,50.8 arc-74 2.54,53.34 63.5,53.34 arc-74 66.04,50.8 66.04,40.64 68.58,38.1 68.58,5.08 66.04,2.54 arc-74 63.5,0 2.54,0 arc-74 0,1.91
  pour Top: 0,50.8 arc-74 2.54,53.34 63.5,53.34 arc-74 66.04,50.8 66.04,40.64 68.58,38.1 68.58,5.08 66.04,2.54 arc-74 63.5,0 2.54,0 arc-74 0,1.91
LINKLED  (via drill 0.4)
  Top 0.254: RN2.7 45.41,18.47 45.17,18.47 44.98,18.27 44.98,17.54 44.52,17.09 RN2.4 43.5,17.09 v43.31,16.89 | IC5.25 42.5,26.75 v42.5,26
  Bottom 0.254: v42.5,26 46,22.5 46,19.56 43.61,17.17 43.59,17.17 v43.31,16.89
N$1  (via drill 0.4)
  Top 0.305: C23.1 21.12,27.84 RN5.8 22.03,26.47 v22.5,26 22.17,25.67 RN5.7
  Bottom 0.305: U1.P$3 22.46,26.04 v22.5,26
N$2
  Top 0.254: IC3.7 54.26,40.71 XTL2.1 55.29,41.74 C20.2
N$3
  Top 0.254: C19.1 38.42,42.42 37.91,41.91 SJ1.2
N$4
  Top 0.254: R3.2 61.63,37.5 62.36,38.23 LED8.C
N$5  (via drill 0.4)
  Top 0.254: IC6.1 36.51,43.76 R5.2 35.81,44.45 v35.05,44.45
  Bottom 0.254: SJ4.2 v35.05,44.45
N$6
  Top 0.254: R3.1 63.33,35.17 64.14,34.42 64.14,33.87 Q2.3
N$7
  Top 0.254: IC3.8 53.46,38.54 51.5,40.5 C21.2 53.1,43.34 XTL2.3
N$8
  Top 0.254: IC2.1 12.95,46.76 14,45.71 14,41.71 14.47,41.24 C8.2 16.71,41.24 XTL1.3
N$9
  Top 0.254: J6.B5 8,37.35 8.35,37 R6.2
N$10
  Top 0.254: IC5.31 44.34,29.75 R11.1 44.5,32.32 44.5,34.24 C4.1 45.6,36.34 XTL3.3
N$11
  Top 0.254: LED4.C 3.25,47.06 2.79,47.5 2.79,49.28 3.17,49.66 3.68,49.66 4.08,50.06 RN3.2
N$12
  Top 0.254: RN4.5 33.2,43.25 33.02,43.43 32.51,43.43 | 32.51,43.43 32.38,43.31 32.38,42.6 RN4.6 | IC4.3 24.89,46.48 25.27,46.86 28.32,46.86 28.96,46.23 28.96,45.21 29.46,44.7 32,44.7 32.51,44.2 32.51,43.43
N$13
  Top 0.254: LED3.C 3.92,50.65 4.06,50.8 4.55,50.8 RN3.1
N$14  (via drill 0.4)
  Top 0.254: RN6.8 51.73,26.07 v51.05,25.4 | LED1.C 62.88,40.78 63.12,41.02 65.02,41.02 65.41,40.64 65.41,39.5 v65.91,38.99 | v56.64,23.5 56.77,23.62 v63.75,23.62
  Bottom 0.254: v65.91,38.99 65.91,38.35 63.61,36.05 63.61,33.17 65.15,31.62 66.8,31.62 67.44,30.99 67.44,24.51 66.55,23.62 v63.75,23.62 | v56.64,23.5 57.02,23.5 57.28,23.24 57.28,21.84 56.77,21.34 55.12,21.34 v51.05,25.4
N$15
  Top 0.813: D2.A 24.35,20.1 J8.4
N$16
  Top 0.254: R2.2 10.24,39.7 Z1.1 9.76,39.76 8.35,38.35 J6.B6 5.65,38.35 5.5,38.5 5.5,39.1 5.75,39.35 J6.A6
N$17
  Top 0.254: R1.2 Z2.1 9.74,41.24 8,39.5 | J6.B7 7.65,39.85 8,39.5 | J6.A7 7.85,38.85 8,39 8,39.5
N$18
  Top 0.254: 24.89,38.48 IC4.6 | 24.89,38.48 25.78,38.48 26.16,38.86 IC4.7 | 24.89,38.48 24.51,38.1 24.51,36.45 24.81,36.15 Q1.1
N$19
  Top 0.254: IC4.5 23.62,41.27 24.38,42.04 26.54,42.04 27.43,42.93 IC4.1
N$20  (via drill 0.4)
  Top 0.254: RN6.4 54.41,22.68 59.44,17.65 v61.21,17.65 62.46,17.65 J11.2 | RN7.8 57.22,11.5 v59.94,14.22
  Bottom 0.254: v59.94,14.22 61.21,15.49 v61.21,17.65
N$21
  Top 0.254: 56.9,26.54 56.9,26.92 57.46,27.5 IC3.22
  Top 0.305: 56.9,26.54 58.04,25.4 A7.1
N$22
  Top 0.254: 56.13,26.54 55.06,27.62 IC3.19
  Top 0.305: 56.13,26.54 A6.1
N$23
  Top 0.254: J11.CD1 55.61,11.83 56.01,11.43 56.01,6.59 56.59,6 61.5,6 61.98,6.48 CD.1
N$24
  Top 0.254: RN6.2 52.81,22.5 57.78,17.53 57.78,15.62 58.29,15.11 60.33,15.11 61.21,14.22 | 61.21,14.22 62.8,14.22 J11.5 | RN7.7 58.02,9.51 60.07,11.56 60.07,13.08 61.21,14.22
N$25
  Top 0.254: RN6.3 53.61,22.59 59.69,16.51 62.89,16.51 J11.3 64.77,16.51 65.15,16.13 65.15,11.94 64.26,11.05 64.26,10.29 64.01,10.03 59.44,10.03 58.82,9.42 RN7.6
N$26
  Top 0.254: RN2.6 46.08,17.89 46.48,18.29 LED6.C
N$27
  Top 0.254: IC5.30 45.36,29.25 R11.2 47.23,34.18 XTL3.1 48.61,34.35 C3.1
N$28
  Top 0.254: RN2.5 46.16,17.09 46.48,16.76 LED7.C
N$29  (via drill 0.4)
  Top 0.254: IC6.3 40.71,43.76 R4.2 41.4,44.45 v42.16,44.45
  Bottom 0.254: SJ3.2 v42.16,44.45
N$30
  Top 0.254: J6.A5 6.62,40.37 8.22,40.37 8.43,40.57 8.5,40.65 R7.2
N$31
  Top 0.254: IC5.20 38.25,23.01 C16.1
N$32  (via drill 0.4)
  Top 0.254: C24.1 v18.25,21
  Top 0.305: C24.1 R12.2
  Bottom 0.254: U1.P$4 13.97,24.47 12.5,23 12.5,21.5 13,21 14.5,21 15.75,19.75 17.75,19.75 18.25,20.25 v18.25,21
N$33
  Top 0.254: IC5.10 31.99,27.75 R10.1
N$34
  Top 0.254: IC5.23 39.77,25.03 39.77,24.16 39.96,23.97 40.53,23.97 42,22.5 R9.1
N$35  (via drill 0.4)
  Top 0.254: R8.1 v43.75,42 | IC5.36 41.95,32.95 42.5,33.5 42.5,36.25 J7.1
  Bottom 0.254: J7.1 43.75,40.5 v43.75,42
N$36
  Top 0.254: IC5.45 36.25,34.82 36.04,35.03 35.5,35.03 34.8,35.73 RN8.1
N$37
  Top 0.254: IC5.44 36.75,35.09 36.34,35.5 36,35.5 35.6,35.9 RN8.2
N$38
  Top 0.254: RN8.3 36.4,36.08 37.25,35.23 IC5.43
N$39
  Top 0.254: IC5.42 37.75,35.77 RN8.4
N$40
  Top 0.254: IC5.41 38.25,35.77 RN9.1
N$41
  Top 0.254: IC5.40 38.75,35.23 39.6,36.08 RN9.2
N$42
  Top 0.254: 40.3,36.33 RN9.3 40.4,35.9 40,35.5 39.66,35.5 39.25,35.09 IC5.39
N$43
  Top 0.254: IC5.38 39.75,34.82 39.96,35.03 40.5,35.03 41.2,35.73 RN9.4
N$44  (via drill 0.35)
  Top 0.254: RN6.5 54.41,26.6 v54.74,26.92
  Bottom 0.254: U$2.1 55.1,27.86 55.1,27.29 v54.74,26.92
N$60
  Top 1.016: J5.PWR 14.46,10.67 20.07,10.67 D1.A
N$67  (via drill 0.4)
  Top 0.254: RN2.1 43.7,20.07 v43.31,20.07
  Bottom 0.254: U1.P$14 5.33,18.03 5.33,19.81 2.29,22.86 2.29,27.69 2.79,28.19 4.7,28.19 12.5,20.39 12.5,19 13,18.5 14.5,18.5 16,17 17,17 19.18,19.18 22.1,19.18 23.91,21 41.61,21 42.55,20.07 v43.31,20.07
N$68
  Top 0.813: U1.P$9 23.37,18.41 25.15,16.51 J8.3
N$69
  Top 0.813: U1.P$10 14.99,17.14 15.75,16.38 22.73,16.38 25.15,13.97 J8.2
N$113
  Top 0.254: IC2.2 13.19,47.26 14.6,45.85 14.6,44.4 15,44 18.05,44 XTL1.1 19.29,42.76 C2.2
N$115
  Top 0.254: J6.A9B4 5.95,36.65 5,37.6 5,40.6 5.95,41.55 J6.A4B9
  Top 0.508: J6.A9B4 7.5,36.65 8.85,35.31
  Top 0.61: 8.85,35.31 F1.1
N$117
  Top 0.254: IC2.27 9.14,46.2 9.14,45.72 8.51,45.09 C11.1
N$327
  Top 0.254: RN1.5 46.3,20.77 LED5.C
N$329
  Top 0.254: RN1.7 46.21,22.37 LED2.C
N$332  (via drill 0.4)
  Top 0.254: RN2.2 43.67,18.69 v43.31,19.05
  Bottom 0.254: U1.P$12 3.54,25.67 3.68,25.53 13.34,15.88 17.77,15.88 19.68,17.78 28.32,17.78 29.72,19.18 42.42,19.18 42.55,19.05 v43.31,19.05
RD+  (via drill 0.4)
  Top 0.254: R2.1 12,39.69 12.37,39.24 v12.95,39.24 | v10.16,43.94 IC2.29
  Bottom 0.254: v12.95,39.24 12.95,41.15 v10.16,43.94
RD-
  Top 0.254: R1.1 11.99,42.85 11.96,43 11.96,43.54 10.66,44.84 IC2.30
RESET  (via drill 0.4)
  Top 0.254: IC3.29 59.22,32.93 v59.05,33.02 | v64.26,42.93 64.52,42.67 S1.4 S1.3 59.44,43.18 57.26,45.36 50.76,45.36 46.03,40.64 42,40.64 | v52.32,4.95 52.2,4.95 51.18,3.94 40.13,3.94 39.37,3.17 39.37,1.91 38.86,1.4 34.16,1.4 J2.3 | v58.04,22.48 64.14,22.48 64.52,22.86 64.52,24 63.63,24.89 63.63,25.34 J9.5 | RN4.2 31.6,41.54 32,41.94 32.02,41.93 33.57,41.93 34,41.5 34,41 34.5,40.5 38,40.5 38.5,41 39.01,41 C19.2 39.22,41 40,41 40.36,40.64 42,40.64 | IC5.37 40.3,34 41,34 42,35 42,40.64
  Bottom 0.254: J9.5 64.9,26.61 64.9,30.99 62.87,33.02 | v64.26,42.93 64.26,37.56 62.9,36.2 62.9,33.05 62.87,33.02 | v52.32,4.95 53.98,4.95 57.66,8.64 57.66,14.61 59.31,16.26 59.31,21.59 58.42,22.48 v58.04,22.48 | v59.05,33.02 62.87,33.02
RESET2  (via drill 0.4)
  Top 0.254: IC2.24 6.37,46.76 v5.71,46.11 | J10.5 17.27,36.7 18.67,38.1 v23.62,38.1 | v28.45,40.39 30.48,40.39 30.73,40.64 30.73,41.16 RN4.1
  Bottom 0.254: v5.71,46.11 5.71,45.85 11.4,40.16 11.4,37.54 14.41,34.54 16.25,34.54 J10.5 | v23.62,38.1 26.16,38.1 v28.45,40.39
RXIN  (via drill 0.4)
  Top 0.254: IC5.5 34.25,30.25 34.5,30.5 v35.01,30.5
  Top 0.305: U1.P$2 17.4,27.3 19.03,25.67 RN5.2
  Bottom 0.254: U1.P$2 13.97,28.32 15.62,29.97 17.53,29.97 18.92,28.57 33.09,28.57 v35.01,30.5
RXIP  (via drill 0.4)
  Top 0.254: IC5.6 35.25,29.75 v35.5,29.5
  Top 0.305: U1.P$1 17.27,28.57 19.37,26.47 RN5.1
  Bottom 0.254: U1.P$1 17.02,28.07 34.07,28.07 v35.5,29.5
RXLED
  Top 0.254: IC2.10 11.16,52.22 10.54,52.83 5.97,52.83 5.28,52.15 5.28,50.22 5.46,50.04 5.94,50.04 RN3.7
SCK2  (via drill 0.4)
  Top 0.254: J10.3 20.07,35.56 v21.34,36.83 | v8.64,51.69 8.66,51.67 IC2.15
  Bottom 0.254: v8.64,51.69 9.4,50.93 9.4,48.26 16.38,41.27 16.38,39.24 18.03,37.59 20.57,37.59 v21.34,36.83
SPDLED  (via drill 0.4)
  Top 0.254: RN2.3 43.33,17.89 v43.31,17.91 | IC5.24 40.95,25.05 v41,25
  Bottom 0.254: v41,25 45,21 45,19.6 v43.31,17.91
TXLED
  Top 0.254: IC2.11 10.66,51.95 10.21,52.4 6.17,52.4 5.84,52.07 5.84,51.56 5.97,51.44 5.97,50.87 RN3.8
TXON  (via drill 0.4)
  Top 0.254: v33,33 33,32.3 IC5.1
  Top 0.305: U1.P$6 17.4,22.23 19.25,24.07 RN5.4
  Bottom 0.254: U1.P$6 17.4,22.23 18.92,23.75 32.03,23.75 37,28.72 37,31.04 35.04,33 v33,33
TXOP  (via drill 0.4)
  Top 0.254: IC5.2 34.75,31.75 v35,32
  Top 0.305: U1.P$5 17.89,24.87 RN5.3
  Bottom 0.254: U1.P$5 17.4,24.38 31.9,24.38 36.5,28.98 36.5,30.5 v35,32
USBRXD  (via drill 0.4)
  Top 0.254: IC2.9 11.66,51.15 v12.06,51.56 | v6.76,48.51 6.7,48.46 RN3.5
  Bottom 0.254: v12.06,51.56 11.25,52.38 6.15,52.38 5.84,52.07 5.84,51.44 7.62,49.66 7.62,48.9 7.24,48.51 v6.76,48.51
USBTXD  (via drill 0.4)
  Top 0.254: RN3.6 6.51,49.26 v6.76,49.51 | IC2.8 12.83,50.88 v12.83,52.2
  Bottom 0.254: v12.83,52.2 12.19,52.83 5.84,52.83 5.33,52.32 5.33,50.16 5.99,49.51 v6.76,49.51
USBVCC
  Top 0.254: IC2.31 11.16,45.36 12.95,43.56 12.95,40.39 13.72,39.62 13.72,38.61 13.21,38.1 13.21,35.05 12.87,34.72 F1.2
  Top 0.61: Q1.3 27.01,33.15 25.74,31.88 23.62,31.88 22.86,31.11 15.62,31.11 12.87,33.86 F1.2
VIN  (via drill 0.4)
  Top 0.254: RN4.3 32.4,40.79 31.88,40.26 v31.5,40.26 | v11.8,23.61 9.79,23.61 v8.65,22.47 | v11.18,19.93 11.18,17.82 13.13,15.87 13.13,13.87 8.89,9.64 8.89,7.11 10.67,5.33 12.95,5.33 15.89,8.27 C5.+
  Top 1.016: v22.86,2.16 22.35,2.16 | v21.84,2.16 22.35,2.16 | 22.35,2.16 22.35,5.84 22.1,6.1 D1.C | 17,8.13 C5.+ 17.01,8.39 D1.C | D1.C 26.68,8.39 27.5,9.21 27.5,13.85 31.15,17.5 IC1.3 31,17.5 28.65,19.85 D2.C
  Bottom 0.254: v11.8,23.61 12.57,24.38 12.57,27.82 15.23,30.48 17.78,30.48 19.18,29.08 28.83,29.08 31.5,31.75 v31.5,40.26 | v8.65,22.47 11.18,19.95 v11.18,19.93
  Bottom 0.813: 45.72,1.52 J2.8
  Bottom 1.016: 45.72,1.52 45.09,0.89 24.13,0.89 v22.86,2.16 v21.84,2.16

## Text on the board
tPlace: USB | TX | RX | SCL | SDA | A | GND | 13 | 12 | 11 | 10 | 9 | 8 | 7 | 6 | 5 | 4 | 3 | 2 | 1 | 0 | REF | PWM | PWM | PWM | Digital | PWM | PWM | PWM | TX | RX | SuperHouse | superhouse.tv | RST | RST-EN | PWR | EtherUNO | INT | D13 | 1 | by | Jon / Oxer | 1 | ICSP | A6 | A7 | ACT | FDX | 100 | LNK | PoE | 7-48V | 7-12V | DC | microSD | C | D | 2.1mm | IO | Power | Analog | SDA | SCL | REF | RST | 3V3 | 5V | GND | GND | VIN | 0 | 1 | 2 | 3 | 4 | 5
bPlace: SCL | SDA | A | GND | 13 | 12 | 11 | 10 | 9 | 8 | 7 | 6 | 5 | 4 | 3 | 2 | 1 | 0 | UBOOT | I2C | REF | PWM | PWM | PWM | Digital | PWM | PWM | PWM | TX | RX | ISOLATE | SDA/SCL | MCP 24AA025E48 I2C / ADDR: 70 (0x50) | Super / House | D4 | www.superhouse.tv/eu | Copyright 2020 SuperHouse Automation P/L / Released under the TAPR / Open Hardware License / tapr.org/OHL | ROHS | SKU: EU | v1.1 | Power | Analog | SDA | SCL | RST | 3V3 | 5V | GND | GND | VIN | 0 | 1 | 2 | 3 | 4 | 5
tDocu: A | K | A | K | K | A | K | A | K | A | K | A | K | A | K | A